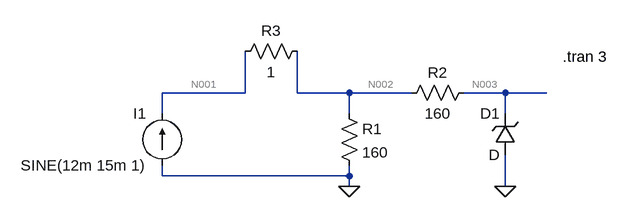
[diagram p0: schematic SDADC.asc]
SDADC.asc, the LTspice schematic file:
Version 4.1
SHEET 1 880 680
WIRE 112 160 112 96
WIRE 112 160 -16 160
WIRE 192 160 192 96
WIRE 272 160 192 160
WIRE 368 160 272 160
WIRE 512 160 448 160
WIRE 576 160 512 160
WIRE -16 192 -16 160
WIRE 272 192 272 160
WIRE 512 192 512 160
WIRE -16 288 -16 272
WIRE 272 288 272 272
WIRE 272 288 -16 288
WIRE 272 304 272 288
WIRE 512 304 512 256
FLAG 272 304 0
FLAG 512 304 0
SYMBOL res 256 176 R0
SYMATTR InstName R1
SYMATTR Value 160
SYMBOL res 464 144 R90
WINDOW 0 0 56 VBottom 2
WINDOW 3 32 56 VTop 2
SYMATTR InstName R2
SYMATTR Value 160
SYMBOL zener 528 256 R180
WINDOW 0 24 64 Left 2
WINDOW 3 24 0 Left 2
SYMATTR InstName D1
SYMBOL current -16 272 R180
WINDOW 0 24 80 Left 2
WINDOW 3 24 0 Left 2
WINDOW 123 0 0 Left 0
WINDOW 39 0 0 Left 0
SYMATTR InstName I1
SYMATTR Value SINE(12m 15m 1)
SYMBOL res 208 80 R90
WINDOW 0 0 56 VBottom 2
WINDOW 3 32 56 VTop 2
SYMATTR InstName R3
SYMATTR Value 1
TEXT 600 104 Left 2 !.tran 3

The netlist it stands for:
* SDADC.asc
R1 N002 0 160
R2 N003 N002 160
D1 0 N003 D
I1 0 N001 SINE(12m 15m 1)
R3 N002 N001 1
.model D D
.lib standard.dio
.tran 3
.backanno
.end

* Results of the author's LTspice run, read from the files saved beside the schematic
* Operating Point, zero values left out:
*   V(n001) = 1.932 V
*   V(n002) = 1.92 V
*   V(n003) = 1.92 V
*   I(D1) = -1.93 pA
*   I(I1) = 12 mA
*   I(R1) = 12 mA
*   I(R2) = -1.93 pA
*   I(R3) = -12 mA
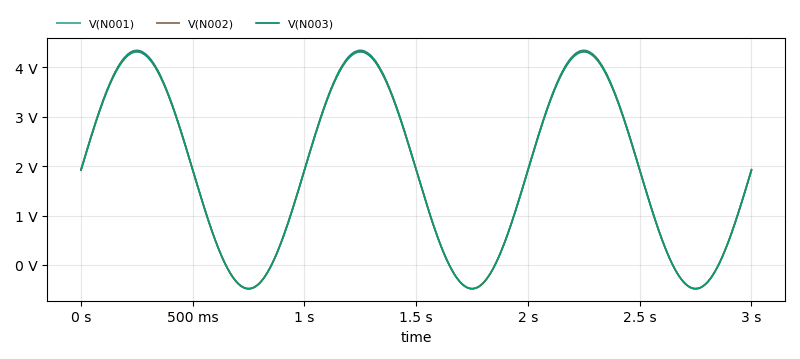
[diagram p1: Transient Analysis of SDADC.asc, plotted from the saved traces]
* Transient Analysis, 1 run:
*   V(N001): min -482.8 mV, max 4.347 V, average 1.932 V, rms 2.579 V, last 1.932 V
*   V(N002): min -479.8 mV, max 4.32 V, average 1.92 V, rms 2.562 V, last 1.92 V
*   V(N003): min -479.6 mV, max 4.32 V, average 1.92 V, rms 2.562 V, last 1.92 V